# Altium schematic sheet Pi5-Interface.SchDoc: Raspberry Pi - Interface
size Letter; ApprovedBy: k.cotton; Engineer: K.Cotton; Organization: Cegep Limoilou; Address1: 1300, 8e Avenue; Address2: Québec, QC; Address3: Canada; Address4: G1J 5L5; SheetNumber: 2; SheetTotal: 5
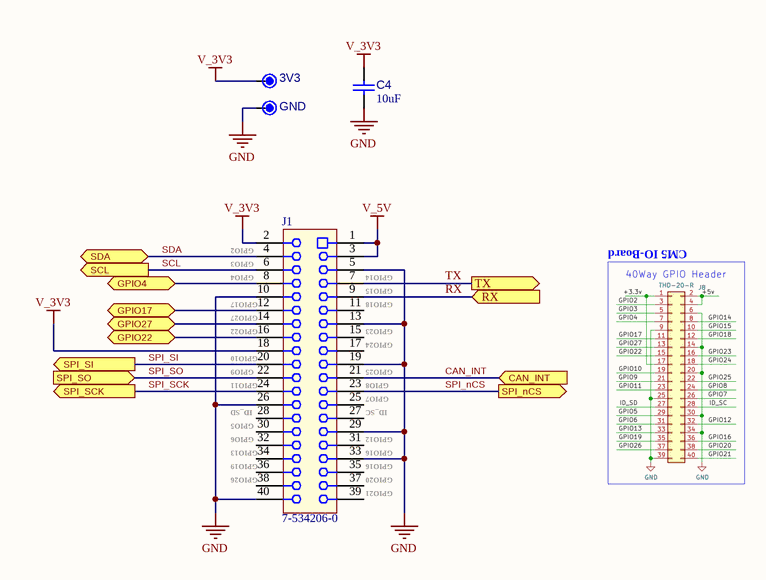
[diagram p0: Pi5-Interface.SchDoc]

## Parts
3V3  DNP  [TP_TH061]  (value not drawn)  (no BOM)
C4  value 10uF  [C_2012[0805]]  (hidden comment: CAP CER 10uF 10V X7R 0805)
GND  DNP  [TP_TH061]  (value not drawn)  (no BOM)
J1  7-534206-0  [CONN_Receptacle_2x20pos_100mil]

## Ports
CAN_INT (in, see 243-5xx_Pi-CAN-PWM[3B]), GPIO4 (bidir, see 243-5xx_Pi-CAN-PWM[2C]), GPIO17 (bidir, see 243-5xx_Pi-CAN-PWM[2C]), GPIO22 (bidir, see 243-5xx_Pi-CAN-PWM[2C]), GPIO27 (bidir, see 243-5xx_Pi-CAN-PWM[2C]), RX (in, see 243-5xx_Pi-CAN-PWM[2C], PMOD-T3-T6[2C]), SCL (out, see 243-5xx_Pi-CAN-PWM[2B], Ctrl-PWM[1B], PMOD-T3-T6[2C]), SDA (bidir, see 243-5xx_Pi-CAN-PWM[2B], Ctrl-PWM[1B], PMOD-T3-T6[2C]), SPI_nCS (out, see 243-5xx_Pi-CAN-PWM[3B], Ctrl-CAN[1C]), SPI_SCK (out, see 243-5xx_Pi-CAN-PWM[3B], Ctrl-CAN[1C]), SPI_SI (out, see 243-5xx_Pi-CAN-PWM[3B], Ctrl-CAN[1C]), SPI_SO (in, see 243-5xx_Pi-CAN-PWM[3B], Ctrl-CAN[1C]), TX (out, see 243-5xx_Pi-CAN-PWM[2C], PMOD-T3-T6[2C])

## Nets
GND: C4.1 GND.1 J1.5 J1.10 J1.13 J1.19 J1.26 J1.29 J1.33 J1.40
V_3V3: 3V3.1 C4.2 J1.2 J1.18
V_5V: J1.1 J1.3
CAN_INT: J1.21 ; port CAN_INT
GPIO4: J1.8 ; port GPIO4
GPIO17: J1.12 ; port GPIO17
GPIO22: J1.16 ; port GPIO22
GPIO27: J1.14 ; port GPIO27
RX: J1.9 ; port RX
SCL: J1.6 ; port SCL
SDA: J1.4 ; port SDA
SPI_nCS: J1.23 ; port SPI_nCS
SPI_SCK: J1.24 ; port SPI_SCK
SPI_SI: J1.20 ; port SPI_SI
SPI_SO: J1.22 ; port SPI_SO
TX: J1.7 ; port TX

Not connected (* = marked no-connect by the designer): J1 11 15 17 25 27 28 30 31 32 34 35 36 37 38 39

## Notes on the sheet
- (near J1) GPIO2
- (near J1) GPIO3
- (near J1) GPIO4
- (near J1) GPIO14
- (near J1) GPIO15
- CM5 IO-Board
- (near J1) GPIO10
- (near J1) GPIO17
- (near J1) GPIO27
- (near J1) GPIO22
- (near J1) GPIO23
- (near J1) GPIO24
- (near J1) GPIO18
- (near J1) GPIO9
- (near J1) GPIO11
- (near J1) GPIO5
- (near J1) ID_SD
- (near J1) GPIO7
- (near J1) GPIO8
- (near J1) GPIO25
- (near J1) ID_SC
- (near J1) GPIO13
- (near J1) GPIO26
- (near J1) GPIO6
- (near J1) GPIO19
- (near J1) GPIO12
- (near J1) GPIO16
- (near J1) GPIO20
- (near J1) GPIO21
- Titre :
- Conception :
- Date :
- Approbation :
- Heure :
- Révision :
- Feuille
- de
- Fichier :

## Library data of the parts
3V3 GND = TP_TH0.61mm(AWG28): Pad TH 0.61mm diameter (AWG28); Value: DNP; Manufacturer Part Number 1: DNP; Supplier Part Number 1: N/A; Supplier 1: N/A
C4 = CAP004: Capacitor type 1; Manufacturer 1: muRata; Manufacturer Part Number 1: GRM21BR71A106KE51L; LibRef: CAP004; Code CEGEP: KCOND03SM; Tolerance: 10%; Rated Voltage: 10V; Dielectric: X7R; Mounting Technology: SMT; Supplier 1: LCSC; Supplier Part Number 1: C86038
J1 = CONN-100MIL-SKT-02X20: CONN SOCKET 2x20POS 2.54mm; Manufacturer 1: Megastar; Manufacturer Part Number 1: ZX-PM2.54-2-20PY; Code CEGEP: CON40; Mounting Technology: TH; Supplier 1: LCSC; Supplier Part Number 1: C7499354; Manufacturer 2: Sullins; Manufacturer 3: TE Connectivity; Manufacturer Part Number 2: PPTC202LFBN-RC; Manufacturer Part Number 3: 7-534206-0; Supplier 2: Digikey; Supplier 3: S6104-ND